# EAGLE schematic main (EAGLE 8.7.0)

## Sheet 1 of 2
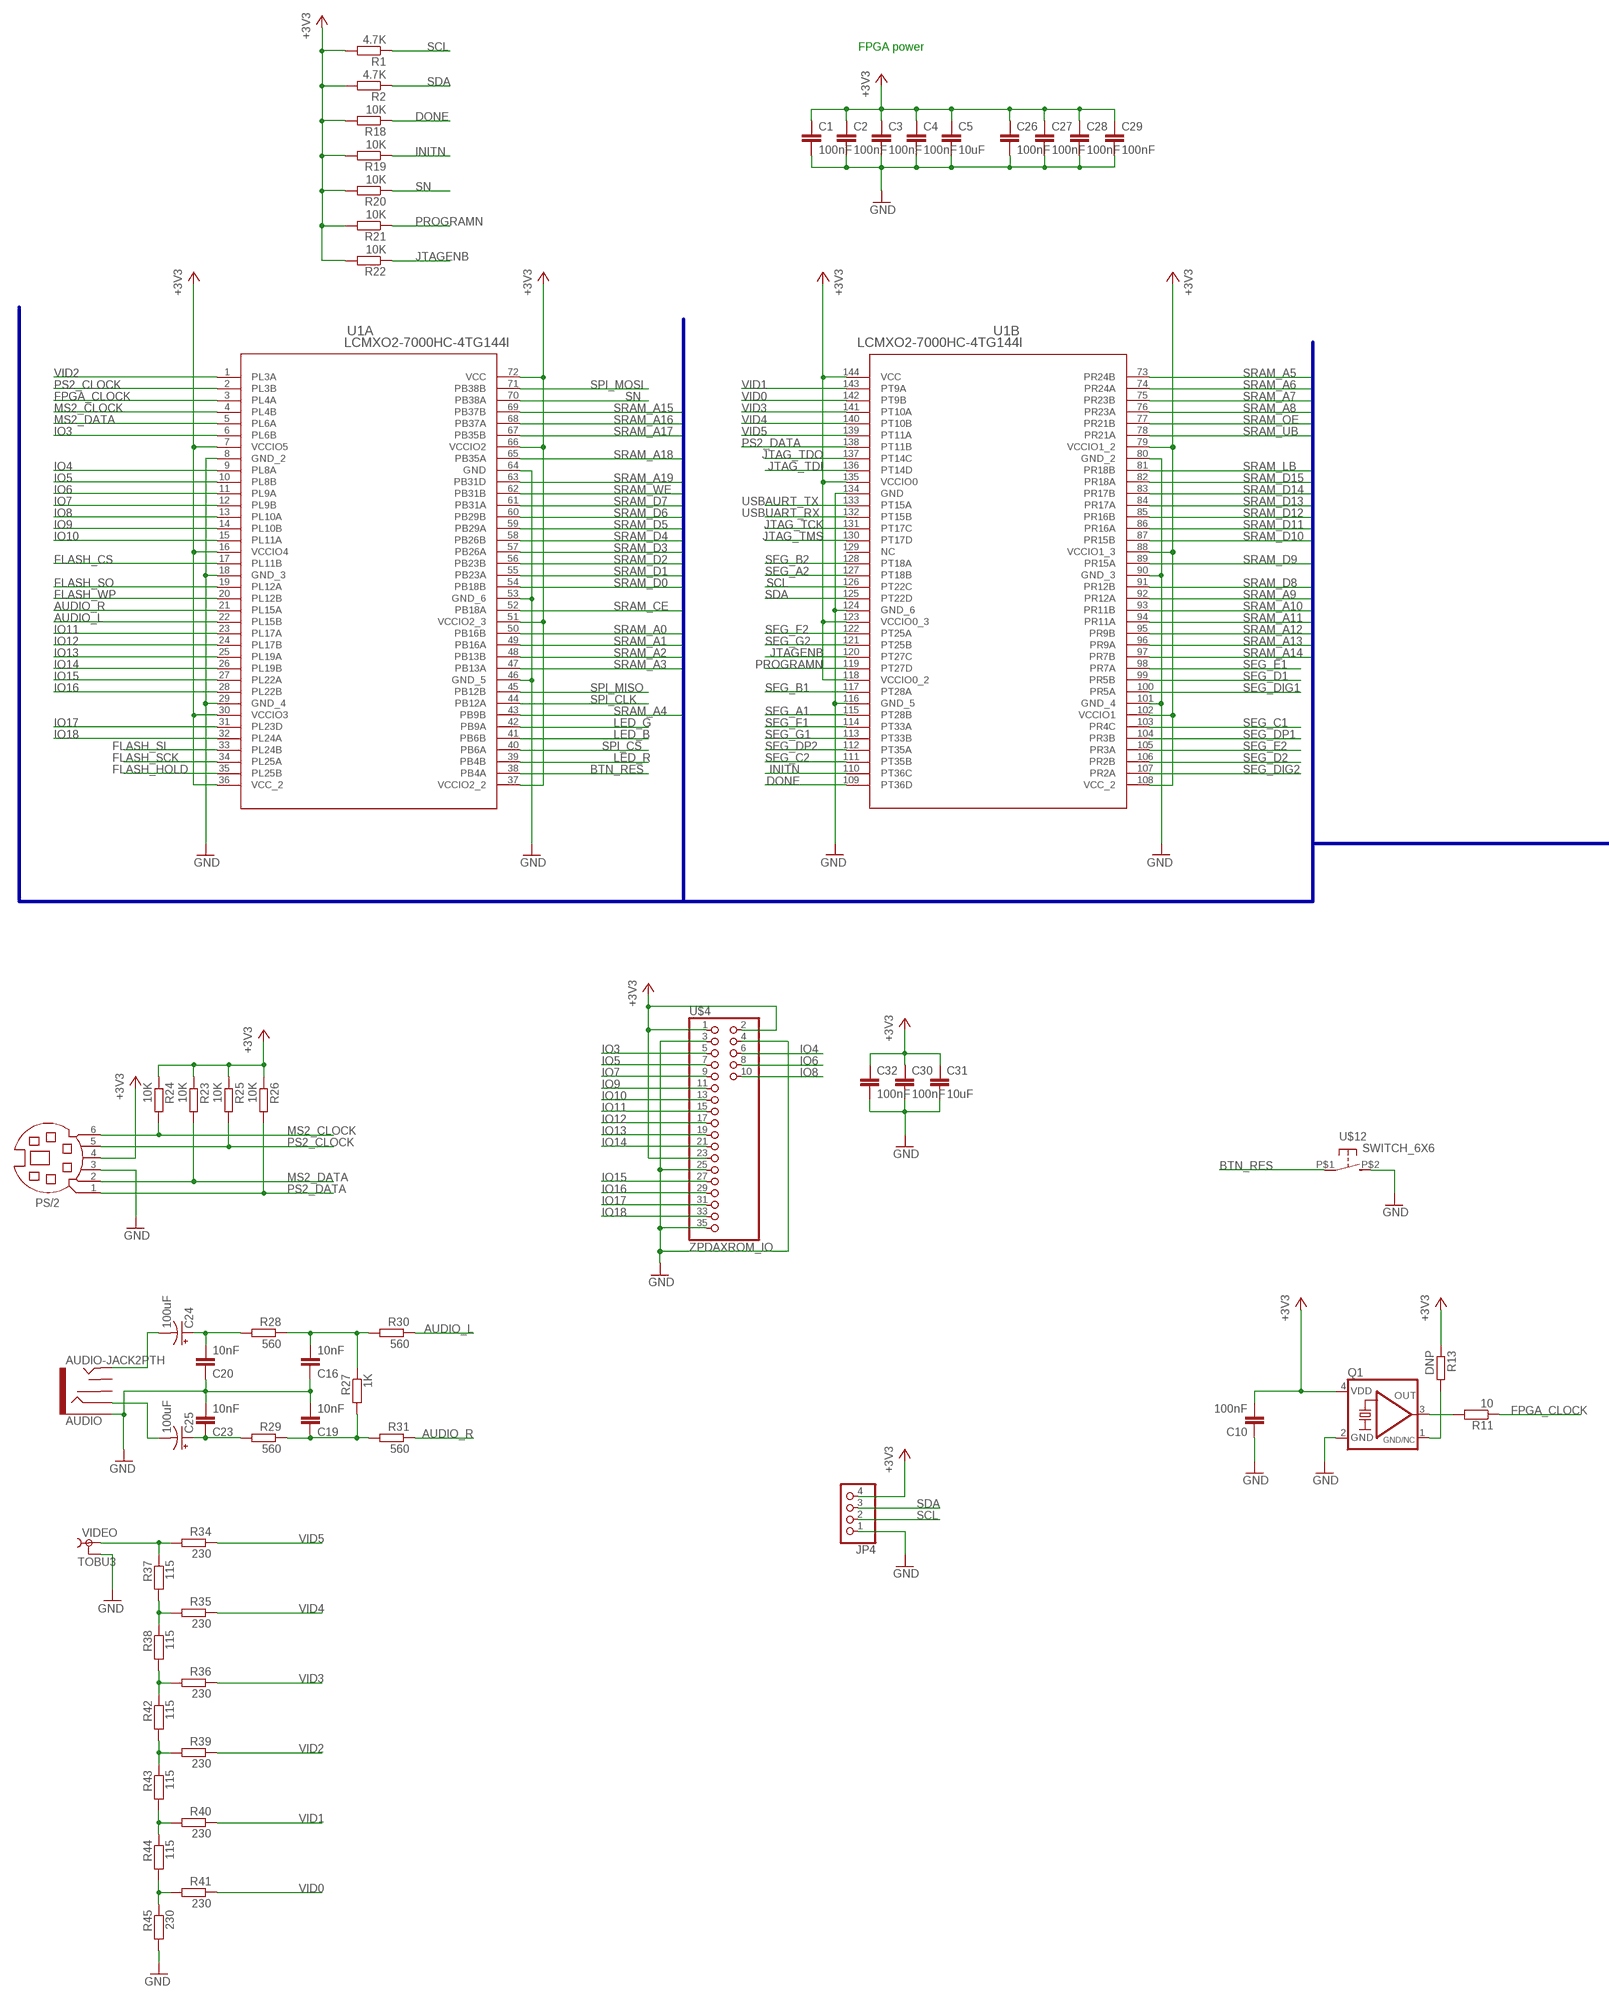
[diagram p0: schematic, sheet 1, part 1 of 2]
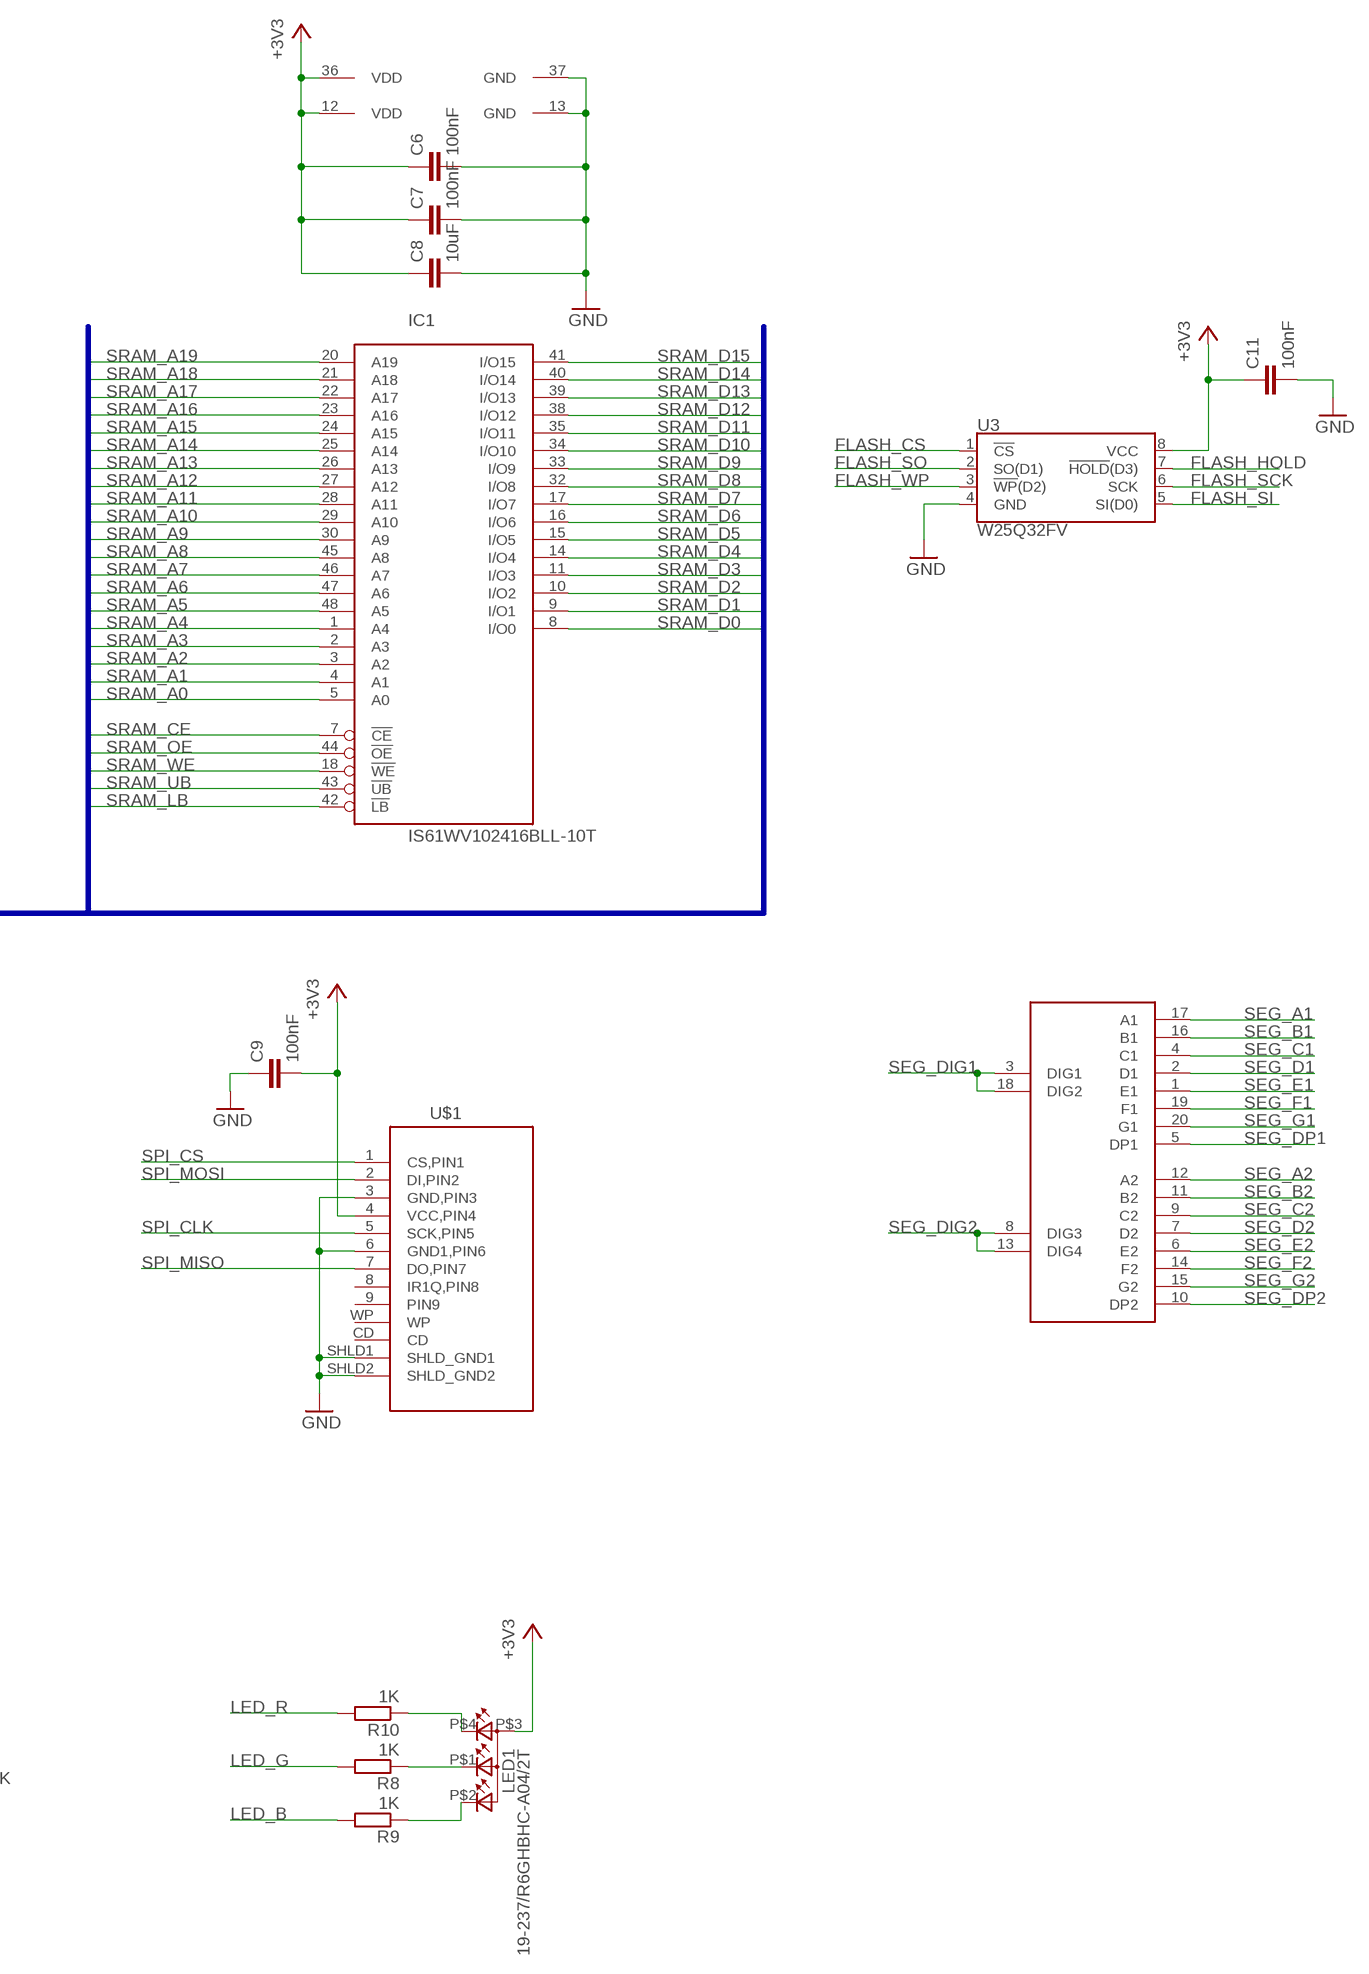
[diagram p1: schematic, sheet 1, part 2 of 2]

### Parts
AUDIO  AUDIO-JACK2PTH  [AUDIO-JACK]
C1  100nF  C-EUC0603  [C0603]
C2  100nF  C-EUC0603  [C0603]
C3  100nF  C-EUC0603  [C0603]
C4  100nF  C-EUC0603  [C0603]
C5  10uF  C-EUC0805  [C0805]
C6  100nF  C-EUC0603  [C0603]
C7  100nF  C-EUC0603  [C0603]
C8  10uF  C-EUC0805  [C0805]
C9  100nF  C-EUC0603  [C0603]
C10  100nF  C-EUC0603  [C0603]
C11  100nF  C-EUC0603  [C0603]
C16  10nF  C-EUC0603  [C0603]
C19  10nF  C-EUC0603  [C0603]
C20  10nF  C-EUC0603  [C0603]
C23  10nF  C-EUC0603  [C0603]
C24  100uF  CAP_POL7343  [EIA7343]
C25  100uF  CAP_POL7343  [EIA7343]
C26  100nF  C-EUC0603  [C0603]
C27  100nF  C-EUC0603  [C0603]
C28  100nF  C-EUC0603  [C0603]
C29  100nF  C-EUC0603  [C0603]
C30  100nF  C-EUC0603  [C0603]
C31  10uF  C-EUC0805  [C0805]
C32  100nF  C-EUC0603  [C0603]
IC1  IS61WV102416BLL-10T  [TSOP-I-48-12X40MM]
JP4  PINHD-1X4  [1X04]
LED1  19-237/R6GHBHC-A04/2T  [19-237/R6GHBHC-A04/2T]
PS/2  MD06SS  [MDIN06SS]
Q1  KXO-TCXO-CMOS-82  [7.0X5.0_KXO-82-TCXO]
R1  4.7K  R-EU_R0603  [R0603]
R2  4.7K  R-EU_R0603  [R0603]
R8  1K  R-EU_R0603  [R0603]
R9  1K  R-EU_R0603  [R0603]
R10  1K  R-EU_R0603  [R0603]
R11  10  R-EU_R0603  [R0603]
R13  DNP  R-EU_R0603  [R0603]
R18  10K  R-EU_R0603  [R0603]
R19  10K  R-EU_R0603  [R0603]
R20  10K  R-EU_R0603  [R0603]
R21  10K  R-EU_R0603  [R0603]
R22  10K  R-EU_R0603  [R0603]
R23  10K  R-EU_R0603  [R0603]
R24  10K  R-EU_R0603  [R0603]
R25  10K  R-EU_R0603  [R0603]
R26  10K  R-EU_R0603  [R0603]
R27  1K  R-EU_R0603  [R0603]
R28  560  R-EU_R0603  [R0603]
R29  560  R-EU_R0603  [R0603]
R30  560  R-EU_R0603  [R0603]
R31  560  R-EU_R0603  [R0603]
R34  230  R-EU_R0603  [R0603]
R35  230  R-EU_R0603  [R0603]
R36  230  R-EU_R0603  [R0603]
R37  115  R-EU_R0603  [R0603]
R38  115  R-EU_R0603  [R0603]
R39  230  R-EU_R0603  [R0603]
R40  230  R-EU_R0603  [R0603]
R41  230  R-EU_R0603  [R0603]
R42  115  R-EU_R0603  [R0603]
R43  115  R-EU_R0603  [R0603]
R44  115  R-EU_R0603  [R0603]
R45  230  R-EU_R0603  [R0603]
U1  LCMXO2-7000HC-4TG144I  [TQFP144]
U3  W25Q32FV  W25Q32FVSS  [SOIC-8]
U$1  FCI_SD_SOCKET  [SD-MMC_SOCKET-PP]
U$3  GS2020CR-G  [GS2020CR]
U$4  ZPDAXROM_IO  [2X18_ZPDAXROM_IO]
U$12  SWITCH_6X6  [SWITCH_6X6]
VIDEO  TOBU3  [TOBU3]

### Nets
+3V3: C1.1 C2.1 C3.1 C4.1 C5.1 C6.1 C7.1 C8.1 C9.2 C10.2 C11.1 C26.1 C27.1 C28.1 C29.1 C30.1 C31.1 C32.1 IC1.12(VDD) IC1.36(VDD) JP4.4 LED1.P$3(A) PS/2.4 Q1.4(VDD) R1.2 R2.2 R13.1 R18.2 R19.2 R20.2 R21.2 R22.2 R23.1 R24.1 R25.1 R26.1 U1.7(A:VCCIO5) U1.16(A:VCCIO4) U1.30(A:VCCIO3) U1.36(A:VCC_2) U1.37(A:VCCIO2_2) U1.51(A:VCCIO2_3) U1.66(A:VCCIO2) U1.72(A:VCC) U1.79(B:VCCIO1_2) U1.88(B:VCCIO1_3) U1.102(B:VCCIO1) U1.108(B:VCC_2) U1.118(B:VCCIO0_2) U1.123(B:VCCIO0_3) U1.135(B:VCCIO0) U1.144(B:VCC) U3.8(VCC) U$1.4(VCC,PIN4) U$4.1 U$4.2 U$4.23 ; also sheet 2
AUDIO_L: R30.1 U1.22(A:PL15B)
AUDIO_R: R31.1 U1.21(A:PL15A)
BTN_RES: U1.38(A:PB4A) U$12.P$1(P)
DONE: R18.1 U1.109(B:PT36D)
FLASH_CS: U1.17(A:PL11B) U3.1(!CS!)
FLASH_HOLD: U1.35(A:PL25B) U3.7(!HOLD!(D3))
FLASH_SCK: U1.34(A:PL25A) U3.6(SCK)
FLASH_SI: U1.33(A:PL24B) U3.5(SI(D0))
FLASH_SO: U1.19(A:PL12A) U3.2(SO(D1))
FLASH_WP: U1.20(A:PL12B) U3.3(!WP!(D2))
FPGA_CLOCK: R11.1 U1.3(A:PL4A)
GND: AUDIO.SLEEVE C1.2 C2.2 C3.2 C4.2 C5.2 C6.2 C7.2 C8.2 C9.1 C10.1 C11.2 C16.1 C19.2 C20.1 C23.2 C26.2 C27.2 C28.2 C29.2 C30.2 C31.2 C32.2 IC1.13(GND) IC1.37(GND) JP4.1 PS/2.3 Q1.2(GND) R45.2 U1.8(A:GND_2) U1.18(A:GND_3) U1.29(A:GND_4) U1.46(A:GND_5) U1.53(A:GND_6) U1.64(A:GND) U1.80(B:GND_2) U1.90(B:GND_3) U1.101(B:GND_4) U1.116(B:GND_5) U1.124(B:GND_6) U1.134(B:GND) U3.4(GND) U$1.3(GND,PIN3) U$1.6(GND1,PIN6) U$1.SHLD1(SHLD_GND1) U$1.SHLD2(SHLD_GND2) U$4.3 U$4.4 U$4.25 U$4.35 U$12.P$2(S) VIDEO.2 VIDEO.2@1 VIDEO.2@2 ; also sheet 2
INITN: R19.1 U1.110(B:PT36C)
IO3: U1.6(A:PL6B) U$4.5
IO4: U1.9(A:PL8A) U$4.6
IO5: U1.10(A:PL8B) U$4.7
IO6: U1.11(A:PL9A) U$4.8
IO7: U1.12(A:PL9B) U$4.9
IO8: U1.13(A:PL10A) U$4.10
IO9: U1.14(A:PL10B) U$4.11
IO10: U1.15(A:PL11A) U$4.13
IO11: U1.23(A:PL17A) U$4.15
IO12: U1.24(A:PL17B) U$4.17
IO13: U1.25(A:PL19A) U$4.19
IO14: U1.26(A:PL19B) U$4.21
IO15: U1.27(A:PL22A) U$4.27
IO16: U1.28(A:PL22B) U$4.29
IO17: U1.31(A:PL23D) U$4.31
IO18: U1.32(A:PL24A) U$4.33
JTAG_TCK: U1.131(B:PT17C) ; also sheet 2
JTAG_TDI: U1.136(B:PT14D) ; also sheet 2
JTAG_TDO: U1.137(B:PT14C) ; also sheet 2
JTAG_TMS: U1.130(B:PT17D) ; also sheet 2
JTAGENB: R22.1 U1.120(B:PT27C)
LED_B: R9.2 U1.41(A:PB6B)
LED_G: R8.2 U1.42(A:PB9A)
LED_R: R10.2 U1.39(A:PB4B)
MS2_CLOCK: PS/2.6 R24.2 U1.4(A:PL4B)
MS2_DATA: PS/2.2 R23.2 U1.5(A:PL6A)
N$2: LED1.P$4(CRED) R10.1
N$4: Q1.3(OUT) R11.2
N$5: LED1.P$1(CBLUE) R8.1
N$10: LED1.P$2(CGREEN) R9.1
N$12: Q1.1(GND/NC) R13.2
N$16: C19.1 R27.2 R29.1 R31.2
N$19: C16.2 R27.1 R28.1 R30.2
N$20: AUDIO.TIP C24.C(-)
N$22: C23.1 C25.A(+) R29.2
N$23: C20.2 C24.A(+) R28.2
N$24: AUDIO.RING C25.C(-)
N$25: R34.2 R37.1 VIDEO.1
N$26: R35.2 R37.2 R38.1
N$27: R36.2 R38.2 R42.1
N$28: R39.2 R42.2 R43.1
N$29: R40.2 R43.2 R44.1
N$30: R41.2 R44.2 R45.1
PROGRAMN: R21.1 U1.119(B:PT27D)
PS2_CLOCK: PS/2.5 R25.2 U1.2(A:PL3B)
PS2_DATA: PS/2.1 R26.2 U1.138(B:PT11B)
SCL: JP4.2 R1.1 U1.126(B:PT22C)
SDA: JP4.3 R2.1 U1.125(B:PT22D)
SEG_A1: U1.115(B:PT28B) U$3.17(A1)
SEG_A2: U1.127(B:PT18B) U$3.12(A2)
SEG_B1: U1.117(B:PT28A) U$3.16(B1)
SEG_B2: U1.128(B:PT18A) U$3.11(B2)
SEG_C1: U1.103(B:PR4C) U$3.4(C1)
SEG_C2: U1.111(B:PT35B) U$3.9(C2)
SEG_D1: U1.99(B:PR5B) U$3.2(D1)
SEG_D2: U1.106(B:PR2B) U$3.7(D2)
SEG_DIG1: U1.100(B:PR5A) U$3.3(DIG1) U$3.18(DIG2)
SEG_DIG2: U1.107(B:PR2A) U$3.8(DIG3) U$3.13(DIG4)
SEG_DP1: U1.104(B:PR3B) U$3.5(DP1)
SEG_DP2: U1.112(B:PT35A) U$3.10(DP2)
SEG_E1: U1.98(B:PR7A) U$3.1(E1)
SEG_E2: U1.105(B:PR3A) U$3.6(E2)
SEG_F1: U1.114(B:PT33A) U$3.19(F1)
SEG_F2: U1.122(B:PT25A) U$3.14(F2)
SEG_G1: U1.113(B:PT33B) U$3.20(G1)
SEG_G2: U1.121(B:PT25B) U$3.15(G2)
SN: R20.1 U1.70(A:PB38A)
SPI_CLK: U1.44(A:PB12A) U$1.5(SCK,PIN5)
SPI_CS: U1.40(A:PB6A) U$1.1(CS,PIN1)
SPI_MISO: U1.45(A:PB12B) U$1.7(DO,PIN7)
SPI_MOSI: U1.71(A:PB38B) U$1.2(DI,PIN2)
SRAM_A0: IC1.5(A0) U1.50(A:PB16B)
SRAM_A1: IC1.4(A1) U1.49(A:PB16A)
SRAM_A2: IC1.3(A2) U1.48(A:PB13B)
SRAM_A3: IC1.2(A3) U1.47(A:PB13A)
SRAM_A4: IC1.1(A4) U1.43(A:PB9B)
SRAM_A5: IC1.48(A5) U1.73(B:PR24B)
SRAM_A6: IC1.47(A6) U1.74(B:PR24A)
SRAM_A7: IC1.46(A7) U1.75(B:PR23B)
SRAM_A8: IC1.45(A8) U1.76(B:PR23A)
SRAM_A9: IC1.30(A9) U1.92(B:PR12A)
SRAM_A10: IC1.29(A10) U1.93(B:PR11B)
SRAM_A11: IC1.28(A11) U1.94(B:PR11A)
SRAM_A12: IC1.27(A12) U1.95(B:PR9B)
SRAM_A13: IC1.26(A13) U1.96(B:PR9A)
SRAM_A14: IC1.25(A14) U1.97(B:PR7B)
SRAM_A15: IC1.24(A15) U1.69(A:PB37B)
SRAM_A16: IC1.23(A16) U1.68(A:PB37A)
SRAM_A17: IC1.22(A17) U1.67(A:PB35B)
SRAM_A18: IC1.21(A18) U1.65(A:PB35A)
SRAM_A19: IC1.20(A19) U1.63(A:PB31D)
SRAM_CE: IC1.7(!CE) U1.52(A:PB18A)
SRAM_D0: IC1.8(I/O0) U1.54(A:PB18B)
SRAM_D1: IC1.9(I/O1) U1.55(A:PB23A)
SRAM_D2: IC1.10(I/O2) U1.56(A:PB23B)
SRAM_D3: IC1.11(I/O3) U1.57(A:PB26A)
SRAM_D4: IC1.14(I/O4) U1.58(A:PB26B)
SRAM_D5: IC1.15(I/O5) U1.59(A:PB29A)
SRAM_D6: IC1.16(I/O6) U1.60(A:PB29B)
SRAM_D7: IC1.17(I/O7) U1.61(A:PB31A)
SRAM_D8: IC1.32(I/O8) U1.91(B:PR12B)
SRAM_D9: IC1.33(I/O9) U1.89(B:PR15A)
SRAM_D10: IC1.34(I/O10) U1.87(B:PR15B)
SRAM_D11: IC1.35(I/O11) U1.86(B:PR16A)
SRAM_D12: IC1.38(I/O12) U1.85(B:PR16B)
SRAM_D13: IC1.39(I/O13) U1.84(B:PR17A)
SRAM_D14: IC1.40(I/O14) U1.83(B:PR17B)
SRAM_D15: IC1.41(I/O15) U1.82(B:PR18A)
SRAM_LB: IC1.42(!LB) U1.81(B:PR18B)
SRAM_OE: IC1.44(!OE) U1.77(B:PR21B)
SRAM_UB: IC1.43(!UB) U1.78(B:PR21A)
SRAM_WE: IC1.18(!WE) U1.62(A:PB31B)
USBAURT_TX: U1.133(B:PT15A) ; also sheet 2
USBUART_RX: U1.132(B:PT15B) ; also sheet 2
VID0: R41.1 U1.142(B:PT9B)
VID1: R40.1 U1.143(B:PT9A)
VID2: R39.1 U1.1(A:PL3A)
VID3: R36.1 U1.141(B:PT10A)
VID4: R35.1 U1.140(B:PT10B)
VID5: R34.1 U1.139(B:PT11A)
Unconnected: AUDIO.RSH AUDIO.TSH U1.129(B:NC) U$1.8(IR1Q,PIN8) U$1.9(PIN9) U$1.CD U$1.WP

### Buses
SRAM_A[0..19],SRAM_D[0..15],SRAM_CE,SRAM_OE,SRAM_WE,SRAM_UB,SRAM_LB,ROM_A[0..19],ROM_D[0..15],ROM_OE,ROM_WE,ROM_CE,ROM_RESET,ROM_BYTE,ROM_WP,ROM_RYBY

### Notes on the sheet
- FPGA power

## Sheet 2 of 2
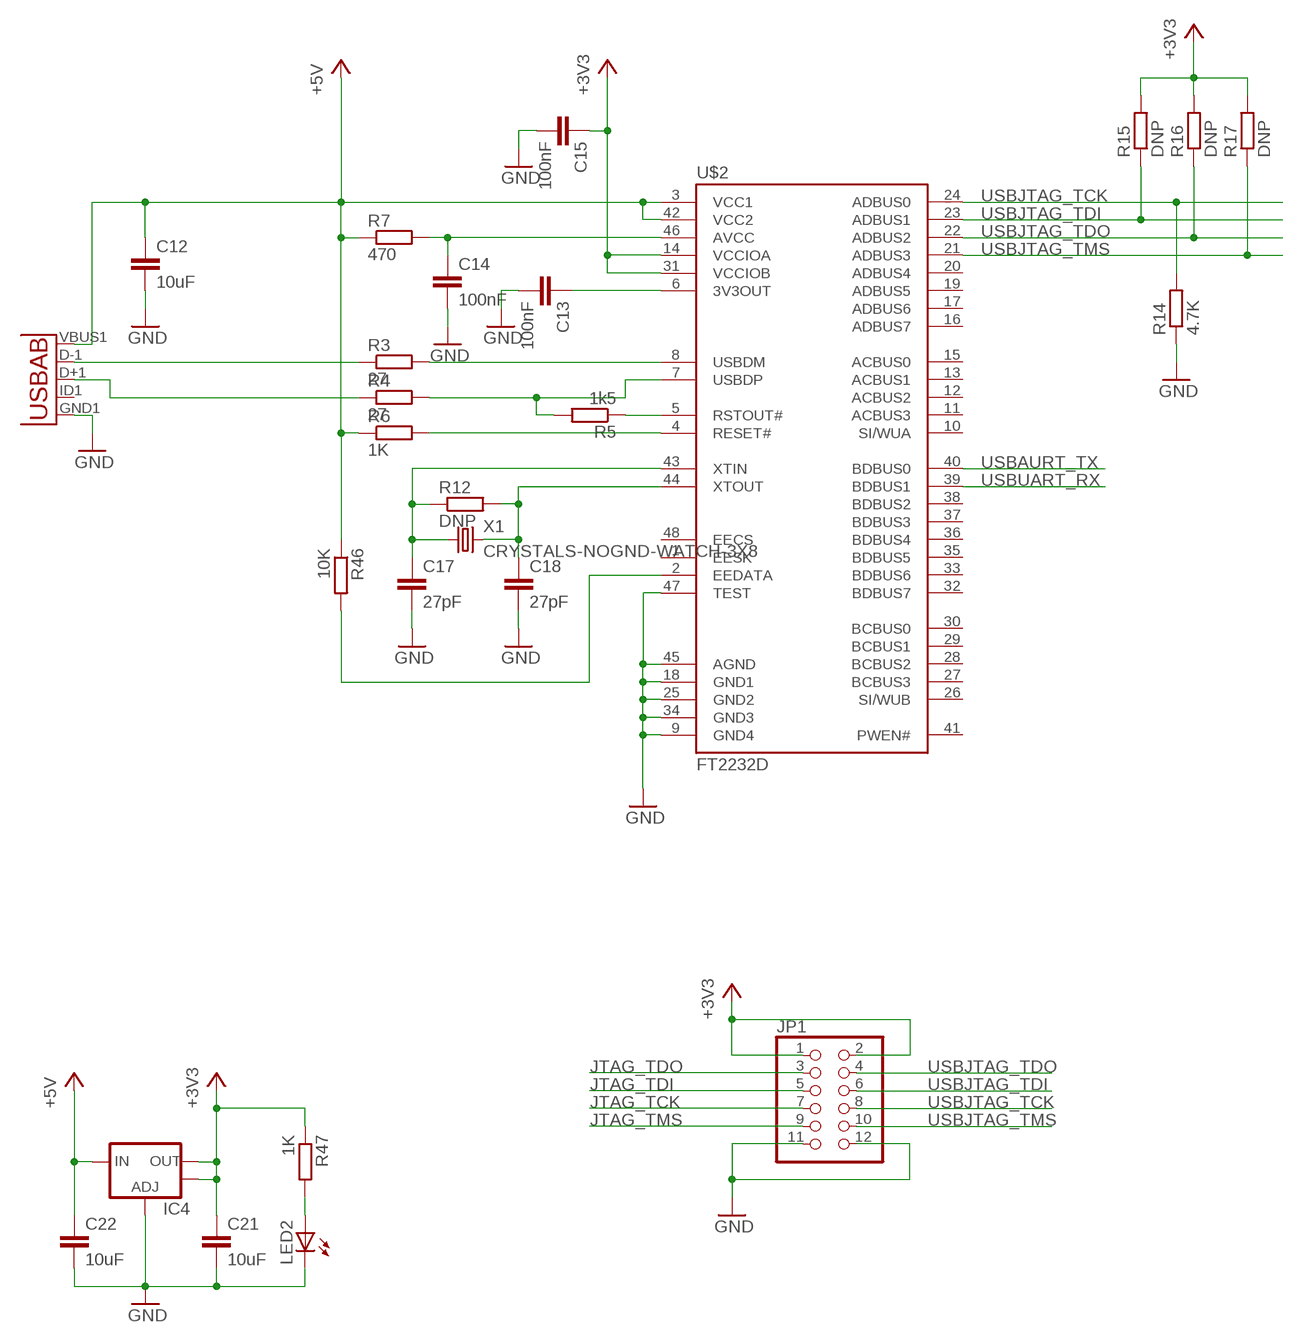
[diagram p2: schematic, sheet 2]

### Parts
C12  10uF  C-EUC0805  [C0805]
C13  100nF  C-EUC0603  [C0603]
C14  100nF  C-EUC0603  [C0603]
C15  100nF  C-EUC0603  [C0603]
C17  27pF  C-EUC0603  [C0603]
C18  27pF  C-EUC0603  [C0603]
C21  10uF  C-EUC0805  [C0805]
C22  10uF  C-EUC0805  [C0805]
IC4  V_REG_LM1117SOT223  [SOT223]
JP1  PINHD-2X6  [2X06]
LED2  LEDCHIPLED_0603  [CHIPLED_0603]
R3  27  R-EU_R0603  [R0603]
R4  27  R-EU_R0603  [R0603]
R5  1k5  R-EU_R0603  [R0603]
R6  1K  R-EU_R0603  [R0603]
R7  470  R-EU_R0603  [R0603]
R12  DNP  R-EU_R0603  [R0603]
R14  4.7K  R-EU_R0603  [R0603]
R15  DNP  R-EU_R0603  [R0603]
R16  DNP  R-EU_R0603  [R0603]
R17  DNP  R-EU_R0603  [R0603]
R46  10K  R-EU_R0603  [R0603]
R47  1K  R-EU_R0603  [R0603]
U2  USB""  [USB-MICRO-SMD]
U$2  FT2232D  [LQFP-48]
X1  CRYSTALS-NOGND-WATCH-3X8  [WATCH-3X8]

### Nets
+3V3: C15.1 C21.1 IC4.2(OUT) IC4.4(OUT) JP1.1 JP1.2 R15.2 R16.2 R17.2 R47.1 U$2.14(VCCIOA) U$2.31(VCCIOB) ; also sheet 1
+5V: C12.1 C22.1 IC4.3(IN) R6.1 R7.1 R46.1 U2.VBUS1(VBUS) U$2.3(VCC1) U$2.42(VCC2)
GND: C12.2 C13.2 C14.2 C15.2 C17.2 C18.2 C21.2 C22.2 IC4.1(ADJ) JP1.11 JP1.12 LED2.C R14.1 U2.GND1(GND) U$2.9(GND4) U$2.18(GND1) U$2.25(GND2) U$2.34(GND3) U$2.45(AGND) U$2.47(TEST) ; also sheet 1
JTAG_TCK: JP1.7 ; also sheet 1
JTAG_TDI: JP1.5 ; also sheet 1
JTAG_TDO: JP1.3 ; also sheet 1
JTAG_TMS: JP1.9 ; also sheet 1
N$1: R3.1 U2.D-1(D-)
N$3: R4.1 U2.D+1(D+)
N$7: R3.2 U$2.8(USBDM)
N$8: C13.1 U$2.6(3V3OUT)
N$9: C14.1 R7.2 U$2.46(AVCC)
N$11: R4.2 R5.2 U$2.7(USBDP)
N$13: R5.1 U$2.5(RSTOUT#)
N$14: R6.2 U$2.4(RESET#)
N$17: C17.1 R12.1 U$2.43(XTIN) X1.1
N$18: C18.1 R12.2 U$2.44(XTOUT) X1.2
N$31: R46.2 U$2.2(EEDATA)
N$32: LED2.A R47.2
USBAURT_TX: U$2.40(BDBUS0) ; also sheet 1
USBJTAG_TCK: JP1.8 R14.2 U$2.24(ADBUS0)
USBJTAG_TDI: JP1.6 R15.1 U$2.23(ADBUS1)
USBJTAG_TDO: JP1.4 R16.1 U$2.22(ADBUS2)
USBJTAG_TMS: JP1.10 R17.1 U$2.21(ADBUS3)
USBUART_RX: U$2.39(BDBUS1) ; also sheet 1
Unconnected: U2.ID1(USBID) U$2.1(EESK) U$2.10(SI/WUA) U$2.11(ACBUS3) U$2.12(ACBUS2) U$2.13(ACBUS1) U$2.15(ACBUS0) U$2.16(ADBUS7) U$2.17(ADBUS6) U$2.19(ADBUS5) U$2.20(ADBUS4) U$2.26(SI/WUB) U$2.27(BCBUS3) U$2.28(BCBUS2) U$2.29(BCBUS1) U$2.30(BCBUS0) U$2.32(BDBUS7) U$2.33(BDBUS6) U$2.35(BDBUS5) U$2.36(BDBUS4) U$2.37(BDBUS3) U$2.38(BDBUS2) U$2.41(PWEN#) U$2.48(EECS)

## Library data of the parts
AUDIO = SparkFun:AUDIO-JACK2
C1-C23 C26-C32 = resistor:C-EU: CAPACITOR, European symbol
C24 C25 = SparkFun:CAP_POL: Capacitor Polarized These are standard SMD and PTH capacitors. Normally 10uF, 47uF, and 100uF in electrolytic and tantalum varieties. Always verify the external diameter of the through hole cap, it varies with capacity, voltage, and manufacturer. The EIA devices should be standard.
IC1 = memory-issi-asynsram:IS61WV102416BLL-*: 1024k x 16 high- speed CMOS static RAM 10ns access time 3.6V power supply
IC4 = SparkFun:V_REG_LM1117: Voltage Regulator LM1117 Standard adjustable voltage regulator but in SMD form. Spark Fun Electronics SKU : COM-00595
JP1 = pinhead:PINHD-2X6: PIN HEADER
JP4 = pinhead:PINHD-1X4: PIN HEADER
LED1 = mouse_enc:19-237/R6GHBHC-A04/2T
LED2 = led:LED: LED OSRAM: - CHIPLED LG R971, LG N971, LY N971, LG Q971, LY Q971, LO R971, LY R971 LH N974, LH R974 LS Q976, LO Q976, LY Q976 LO Q996 - Hyper CHIPLED LW Q18S LB Q993, LB Q99A, LB R99A - SideLED LS A670, LO A670, LY A670, LG A670, LP A670 LB A673, LV A673, LT A673, LW A673 LH A674 LY A675 LS A676, LA A676, LO A676, LY A676, LW A676 LS A679, LY A679, LG A679 - Hyper Micro SIDELED® LS Y876, LA Y876, LO Y876, LY Y876 LT Y87S - SmartLED LW L88C, LW L88S LB L89C, LB L89S, LG L890 LS L89K, LO L89K, LY L89K LS L896, LA L896, LO L896, LY L896 - TOPLED LS T670, LO T670, LY T670, LG T670, LP T670 LSG T670, LSP T670, LSY T670, LOP T670, LYG T670 LG T671, LOG T671, LSG T671 LB T673, LV T673, LT T673, LW T673 LH T674 LS T676, LA T676, LO T676, LY T676, LB T676, LH T676, LSB T676, LW T676 LB T67C, LV T67C, LT T67C, LS T67K, LO T67K, LY T67K, LW E67C LS E67B, LA E67B, LO E67B, LY E67B, LB E67C, LV E67C, LT E67C LW T67C LS T679, LY T679, LG T679 LS T770, LO T770, LY T770, LG T770, LP T770 LB T773, LV T773, LT T773, LW T773 LH T774 LS E675, LA E675, LY E675, LS T675 LS T776, LA T776, LO T776, LY T776, LB T776 LHGB T686 LT T68C, LB T68C - Hyper Mini TOPLED® LB M676 - Mini TOPLED Santana® LG M470 LS M47K, LO M47K, LY M47K Source: http://www.osram.convergy.de LUXEON: - LUMILED® LXK2-PW12-R00, LXK2-PW12-S00, LXK2-PW14-U00, LXK2-PW14-V00 LXK2-PM12-R00, LXK2-PM12-S00, LXK2-PM14-U00 LXK2-PE12-Q00, LXK2-PE12-R00, LXK2-PE12-S00, LXK2-PE14-T00, LXK2-PE14-U00 LXK2-PB12-K00, LXK2-PB12-L00, LXK2-PB12-M00, LXK2-PB14-N00, LXK2-PB14-P00, LXK2-PB14-Q00 LXK2-PR12-L00, LXK2-PR12-M00, LXK2-PR14-Q00, LXK2-PR14-R00 LXK2-PD12-Q00, LXK2-PD12-R00, LXK2-PD12-S00 LXK2-PH12-R00, LXK2-PH12-S00 LXK2-PL12-P00, LXK2-PL12-Q00, LXK2-PL12-R00 Source: www.luxeon.com KINGBRIGHT: KA-3528ASYC Source: www.kingbright.com
PS/2 = con-yamaichi:MD06SS: YAMAICHI CONNECTOR; OC_FARNELL: unknown; OC_NEWARK: unknown
Q1 = crystal-geyer_V1_0:KXO-TCXO-CMOS: TCXO : CMOS - Serie Model Size l/w/h [mm] Frequency Range Frequency Stability Temp. Range [°C] Output AECQ 200 availabel Datasheet KXO-86 KXO-84 KXO-83 KXO-82 2.5/2.0/0.7 3.2/2.5/1.0 5.0/3.2/1.5 7.0/5.0/2.4 13,0 ~ 40,0 MHz 10,0 ~ 40,0 MHz 10,0 ~ 40,0 MHz 10,0 ~ 30,0 MHz ±1,0 … ±2,5ppm ±1,0 … ±2,5ppm ±1,0 … ±3,0ppm ±1,0 … ±3,0ppm (*) -30°C …+75°C (*) -40°C …+85°C (*) -40°C …+85°C (*) -30°C …+80°C CMOS CMOS CMOS CMOS - - - - KXO-86.pdf <http://www.geyer-electronic.de/uploads/tx_userartikelfrequenz/GEYER-KXO-86-TCXO-HCMOS.pdf> KXO-84.pdf <http://www.geyer-electronic.de/uploads/tx_userartikelfrequenz/GEYER-KXO-84-TCXO-HCMOS.pdf> KXO-83.pdf <http://www.geyer-electronic.de/uploads/tx_userartikelfrequenz/GEYER-KXO-83-TCXO-HCMOS.pdf> KXO-82.pdf <http://www.geyer-electronic.de/uploads/tx_userartikelfrequenz/GEYER-KXO-82-TCXO-HCMOS.pdf> <http://www.geyer-electronic.de/fileadmin/template/img/logo-geyer-electronic.png> Details see: http://www.geyer-electronic.de/Frequenz-Produkte.9.0.html Created 2016-06-07, Hans Locher 2016 (C) Geyer Quartz Technology KXO86,KXO84,KXO83,KXO82;2550;3225;5032;7050;2,5x2,0;3,2x2,5;2.5x2.0;3.2x2.5,5,0x3,2;7,0x5,0,5.0x3.2,7.0x5.0
R1-R31 R34-R47 = resistor:R-EU_: RESISTOR, European symbol
U1 = x02-7000hc-4tg144i:LCMXO2-7000HC-4TG144I; MANUFACTURER_PART_NUMBER: LCMXO27000HC4TG144I; VENDOR: Lattice
U2 = MicroUSB:USB: This is a USB AB connector that is compatible with USB OTG. i.e. this connector can serve as a host or device
U3 = SparkFun-IC-Memory:W25Q32FV: W25Q32FV 32Mb (4MB) Serial Flash Memory The W25Q32FV support the standard Serial Peripheral Interface (SPI), Dual/Quad I/O SPI as well as 2-clocks instruction cycle Quad Peripheral Interface (QPI). 104MHz, SPI, 8-SOIC-EIAJ Datasheet <http://www.winbond.com/resource-files/w25q32fv%20revh%20091613.pdf> SparkFun Products SparkFun Blynk Board - ESP8266 <https://www.sparkfun.com/products/13794> (WRL-13794); PROD_ID: IC-13229
U$1 = stepfpga:FCI_SD_SOCKET: FCI Memory Card Connector (SD card); MF: FCI; MOUSER: 649-10067847-001RLF; MPN: 10067847-001RLF
U$2 = SparkFun:FT2232D
U$3 = pdaxrom:GS2020CR-G
U$4 = pdaxrom:ZPDAXROM_IO
U$12 = mouse_enc:SWITCH_6X6
VIDEO = con-hirschmann:TOBU3: Female Cinch CONNECTOR ( RCA Jack ); MF: FARNELL; MPN: TOBU 3; OC_FARNELL: 592791; OC_NEWARK: 06WX5914
X1 = IQD-Frequency-Products:CRYSTALS-NOGND: CRYSTALS CAN NOT GROUNDED